# EAGLE schematic mosfet-drv (EAGLE 6.5.0)
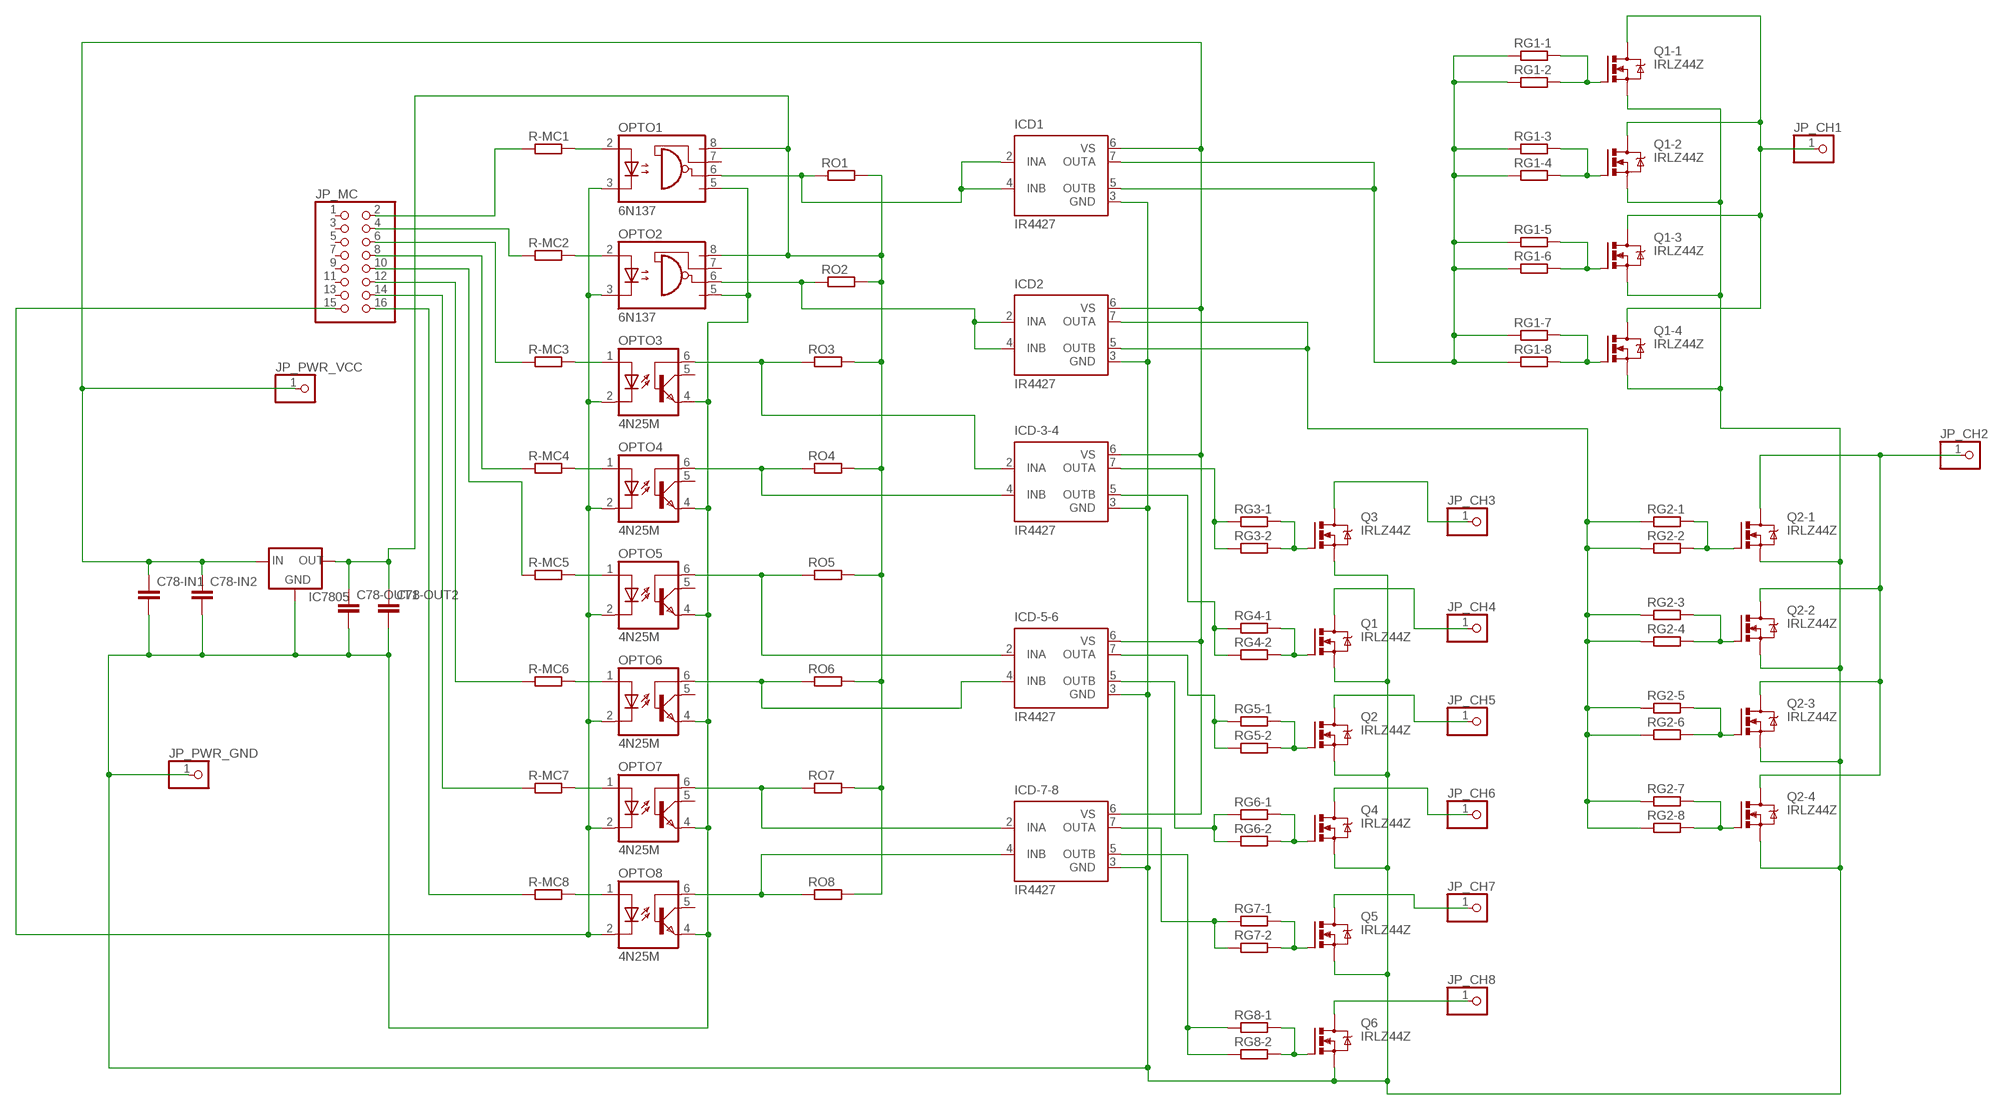
[diagram p0: schematic, sheet 1]

## Parts
C78-IN1  C-EU025-060X050  [C025-060X050]
C78-IN2  C-EU025-060X050  [C025-060X050]
C78-OUT1  C-EU025-060X050  [C025-060X050]
C78-OUT2  C-EU025-060X050  [C025-060X050]
IC7805  78XXS  [78XXS]
ICD1  IR4427  [DIL08]
ICD2  IR4427  [DIL08]
ICD-3-4  IR4427  [DIL08]
ICD-5-6  IR4427  [DIL08]
ICD-7-8  IR4427  [DIL08]
JP_CH1  PINHD-1X1  [1X01]
JP_CH2  PINHD-1X1  [1X01]
JP_CH3  PINHD-1X1  [1X01]
JP_CH4  PINHD-1X1  [1X01]
JP_CH5  PINHD-1X1  [1X01]
JP_CH6  PINHD-1X1  [1X01]
JP_CH7  PINHD-1X1  [1X01]
JP_CH8  PINHD-1X1  [1X01]
JP_MC  PINHD-2X8  [2X08]
JP_PWR_GND  PINHD-1X1  [1X01]
JP_PWR_VCC  PINHD-1X1  [1X01]
OPTO1  6N137  [DIL08]
OPTO2  6N137  [DIL08]
OPTO3  4N25M  [DIL06]
OPTO4  4N25M  [DIL06]
OPTO5  4N25M  [DIL06]
OPTO6  4N25M  [DIL06]
OPTO7  4N25M  [DIL06]
OPTO8  4N25M  [DIL06]
Q1  IRLZ44Z  [TO220BH]
Q1-1  IRLZ44Z  [TO220BH]
Q1-2  IRLZ44Z  [TO220BH]
Q1-3  IRLZ44Z  [TO220BH]
Q1-4  IRLZ44Z  [TO220BH]
Q2  IRLZ44Z  [TO220BH]
Q2-1  IRLZ44Z  [TO220BH]
Q2-2  IRLZ44Z  [TO220BH]
Q2-3  IRLZ44Z  [TO220BH]
Q2-4  IRLZ44Z  [TO220BH]
Q3  IRLZ44Z  [TO220BH]
Q4  IRLZ44Z  [TO220BH]
Q5  IRLZ44Z  [TO220BH]
Q6  IRLZ44Z  [TO220BH]
R-MC1  R-EU_0207/15  [0207/15]
R-MC2  R-EU_0207/15  [0207/15]
R-MC3  R-EU_0207/15  [0207/15]
R-MC4  R-EU_0207/15  [0207/15]
R-MC5  R-EU_0207/15  [0207/15]
R-MC6  R-EU_0207/15  [0207/15]
R-MC7  R-EU_0207/15  [0207/15]
R-MC8  R-EU_0207/15  [0207/15]
RG1-1  R-EU_0207/15  [0207/15]
RG1-2  R-EU_0207/15  [0207/15]
RG1-3  R-EU_0207/15  [0207/15]
RG1-4  R-EU_0207/15  [0207/15]
RG1-5  R-EU_0207/15  [0207/15]
RG1-6  R-EU_0207/15  [0207/15]
RG1-7  R-EU_0207/15  [0207/15]
RG1-8  R-EU_0207/15  [0207/15]
RG2-1  R-EU_0207/15  [0207/15]
RG2-2  R-EU_0207/15  [0207/15]
RG2-3  R-EU_0207/15  [0207/15]
RG2-4  R-EU_0207/15  [0207/15]
RG2-5  R-EU_0207/15  [0207/15]
RG2-6  R-EU_0207/15  [0207/15]
RG2-7  R-EU_0207/15  [0207/15]
RG2-8  R-EU_0207/15  [0207/15]
RG3-1  R-EU_0207/15  [0207/15]
RG3-2  R-EU_0207/15  [0207/15]
RG4-1  R-EU_0207/15  [0207/15]
RG4-2  R-EU_0207/15  [0207/15]
RG5-1  R-EU_0207/15  [0207/15]
RG5-2  R-EU_0207/15  [0207/15]
RG6-1  R-EU_0207/15  [0207/15]
RG6-2  R-EU_0207/15  [0207/15]
RG7-1  R-EU_0207/15  [0207/15]
RG7-2  R-EU_0207/15  [0207/15]
RG8-1  R-EU_0207/15  [0207/15]
RG8-2  R-EU_0207/15  [0207/15]
RO1  R-EU_0207/15  [0207/15]
RO2  R-EU_0207/15  [0207/15]
RO3  R-EU_0207/15  [0207/15]
RO4  R-EU_0207/15  [0207/15]
RO5  R-EU_0207/15  [0207/15]
RO6  R-EU_0207/15  [0207/15]
RO7  R-EU_0207/15  [0207/15]
RO8  R-EU_0207/15  [0207/15]

## Nets
N$1: C78-IN1.2 C78-IN2.2 C78-OUT1.2 C78-OUT2.2 IC7805.GND ICD1.3(GND) ICD2.3(GND) ICD-3-4.3(GND) ICD-5-6.3(GND) ICD-7-8.3(GND) JP_PWR_GND.1 OPTO1.5(GND) OPTO2.5(GND) OPTO3.4(EMI) OPTO4.4(EMI) OPTO5.4(EMI) OPTO6.4(EMI) OPTO7.4(EMI) OPTO8.4(EMI) Q1-1.S Q1-2.S Q1-3.S Q1-4.S Q1.S Q2-1.S Q2-2.S Q2-3.S Q2-4.S Q2.S Q3.S Q4.S Q5.S Q6.S
N$2: C78-IN1.1 C78-IN2.1 IC7805.IN ICD1.6(VS) ICD2.6(VS) ICD-3-4.6(VS) ICD-5-6.6(VS) ICD-7-8.6(VS) JP_PWR_VCC.1
N$3: C78-OUT1.1 C78-OUT2.1 IC7805.OUT OPTO1.8(VCC) OPTO2.8(VCC) RO1.2 RO2.2 RO3.2 RO4.2 RO5.2 RO6.2 RO7.2 RO8.2
N$4: OPTO1.2(A) R-MC1.2
N$5: OPTO2.2(A) R-MC2.2
N$6: OPTO3.1(A) R-MC3.2
N$7: OPTO4.1(A) R-MC4.2
N$8: OPTO5.1(A) R-MC5.2
N$9: OPTO6.1(A) R-MC6.2
N$10: OPTO7.1(A) R-MC7.2
N$11: OPTO8.1(A) R-MC8.2
N$12: JP_MC.2 R-MC1.1
N$13: JP_MC.4 R-MC2.1
N$14: JP_MC.6 R-MC3.1
N$15: JP_MC.8 R-MC4.1
N$16: JP_MC.10 R-MC5.1
N$17: JP_MC.12 R-MC6.1
N$18: JP_MC.14 R-MC7.1
N$19: JP_MC.16 R-MC8.1
N$20: ICD1.2(INA) ICD1.4(INB) OPTO1.6(VO) RO1.1
N$21: JP_MC.15 OPTO1.3(C) OPTO2.3(C) OPTO3.2(C) OPTO4.2(C) OPTO5.2(C) OPTO6.2(C) OPTO7.2(C) OPTO8.2(C)
N$22: ICD2.2(INA) ICD2.4(INB) OPTO2.6(VO) RO2.1
N$23: ICD-3-4.2(INA) OPTO3.6(BAS) RO3.1
N$24: ICD-3-4.4(INB) OPTO4.6(BAS) RO4.1
N$25: ICD-5-6.2(INA) OPTO5.6(BAS) RO5.1
N$26: ICD-5-6.4(INB) OPTO6.6(BAS) RO6.1
N$27: ICD-7-8.2(INA) OPTO7.6(BAS) RO7.1
N$28: ICD-7-8.4(INB) OPTO8.6(BAS) RO8.1
N$29: Q1-1.G RG1-1.2 RG1-2.2
N$30: ICD1.5(OUTB) ICD1.7(OUTA) RG1-1.1 RG1-2.1 RG1-3.1 RG1-4.1 RG1-5.1 RG1-6.1 RG1-7.1 RG1-8.1
N$31: Q1-2.G RG1-3.2 RG1-4.2
N$32: Q1-3.G RG1-5.2 RG1-6.2
N$33: Q1-4.G RG1-7.2 RG1-8.2
N$34: Q2-1.G RG2-1.2 RG2-2.2
N$35: JP_CH1.1 Q1-1.D Q1-2.D Q1-3.D Q1-4.D
N$37: ICD2.5(OUTB) ICD2.7(OUTA) RG2-1.1 RG2-2.1 RG2-3.1 RG2-4.1 RG2-5.1 RG2-6.1 RG2-7.1 RG2-8.1
N$38: Q2-2.G RG2-3.2 RG2-4.2
N$39: Q2-3.G RG2-5.2 RG2-6.2
N$40: Q2-4.G RG2-7.2 RG2-8.2
N$41: JP_CH2.1 Q2-1.D Q2-2.D Q2-3.D Q2-4.D
N$42: JP_CH3.1 Q3.D
N$43: ICD-3-4.7(OUTA) RG3-1.1 RG3-2.1
N$44: Q3.G RG3-1.2 RG3-2.2
N$45: ICD-3-4.5(OUTB) RG4-1.1 RG4-2.1
N$46: Q1.G RG4-1.2 RG4-2.2
N$47: JP_CH4.1 Q1.D
N$49: ICD-7-8.5(OUTB) RG8-1.1 RG8-2.1
N$50: ICD-5-6.7(OUTA) RG5-1.1 RG5-2.1
N$51: Q2.G RG5-1.2 RG5-2.2
N$52: JP_CH5.1 Q2.D
N$53: ICD-7-8.7(OUTA) RG7-1.1 RG7-2.1
N$54: ICD-5-6.5(OUTB) RG6-1.1 RG6-2.1
N$55: Q4.G RG6-1.2 RG6-2.2
N$56: JP_CH6.1 Q4.D
N$57: Q6.G RG8-1.2 RG8-2.2
N$58: JP_CH8.1 Q6.D
N$59: Q5.G RG7-1.2 RG7-2.2
N$60: JP_CH7.1 Q5.D
Unconnected: JP_MC.1 JP_MC.3 JP_MC.5 JP_MC.7 JP_MC.9 JP_MC.11 JP_MC.13 OPTO1.7(VE) OPTO2.7(VE) OPTO3.5(COL) OPTO4.5(COL) OPTO5.5(COL) OPTO6.5(COL) OPTO7.5(COL) OPTO8.5(COL)

## Library data of the parts
C78-IN1 C78-IN2 C78-OUT1 C78-OUT2 = rcl:C-EU: CAPACITOR, European symbol
IC7805 = v-reg:78XXS: VOLTAGE REGULATOR
ICD1 ICD2 ICD-3-4 ICD-5-6 ICD-7-8 = ir:IR4427: DUAL LOW SIDE DRIVER Source: ID4426.pdf; MF: INTERNATIONAL RECTIFIER(IR); MPN: IR4427; OC_FARNELL: 1023267; OC_NEWARK: 27C6914
JP_CH1-JP_CH8 JP_PWR_GND JP_PWR_VCC = dbg-misc:PINHD-1X1: PIN HEADER
JP_MC = pinhead:PINHD-2X8: PIN HEADER
OPTO1 OPTO2 = optocoupler:6N137: MOTOROLA OPTO COUPLER; MPN: 6N137; OC_FARNELL: 1328376; OC_NEWARK: 52M1895
OPTO3-OPTO8 = optocoupler:4N*?M: General Purpose 6-Pin Phototransistor Optocouplers Source: http://www.fairchildsemi.com/ds/4N/4N35-M.pdf; MPN: 4N25-M; OC_FARNELL: 1021349; OC_NEWARK: 98K9084
Q1 Q1-1-Q1-4 Q2 Q2-1-Q2-4 Q3-Q6 = transistor-power:IRLZ44Z: N-Channel HEXFET® Power MOSFET Logic Level AUTOMOTIVE MOSFET Source: http://www.irf.com/product-info/datasheets/data/irlz44zpbf.pdf
R-MC1-R-MC8 RG1-1-RG1-8 RG2-1-RG2-8 RG3-1 RG3-2 RG4-1 RG4-2 RG5-1 RG5-2 RG6-1 RG6-2 RG7-1 RG7-2 RG8-1 RG8-2 RO1-RO8 = rcl:R-EU_: RESISTOR, European symbol